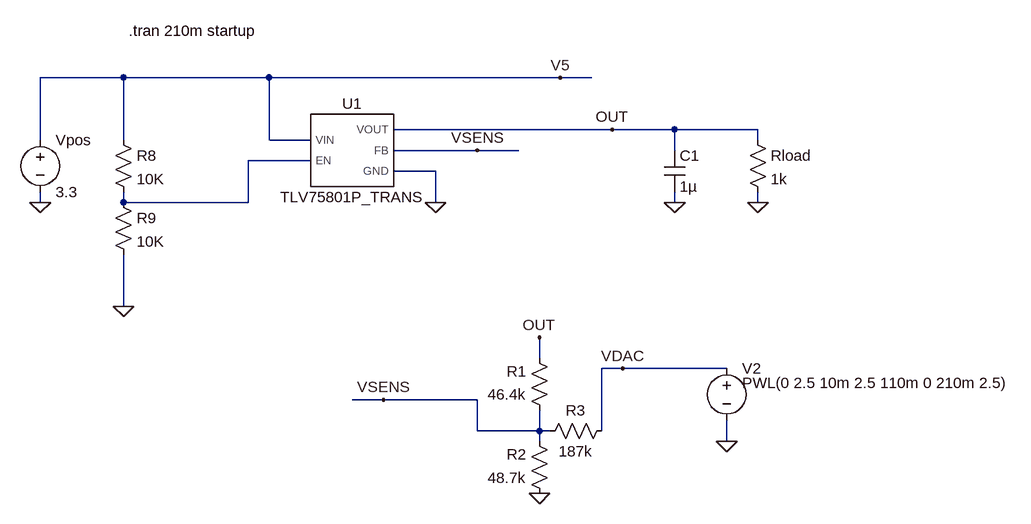
[diagram p0: schematic power_supply_TLV7580.asc]
power_supply_TLV7580.asc, the LTspice schematic file:
Version 4
SHEET 1 1920 776
WIRE -128 -48 -256 -48
WIRE 96 -48 -128 -48
WIRE 544 -48 96 -48
WIRE 592 -48 544 -48
WIRE 624 32 288 32
WIRE 720 32 624 32
WIRE 848 32 720 32
WIRE -256 48 -256 -48
WIRE -128 48 -128 -48
WIRE 96 48 96 -48
WIRE 160 48 96 48
WIRE 848 48 848 32
WIRE 416 64 288 64
WIRE 480 64 416 64
WIRE 720 64 720 32
WIRE 160 80 64 80
WIRE 352 96 288 96
WIRE -256 144 -256 128
WIRE -128 144 -128 128
WIRE 64 144 64 80
WIRE 64 144 -128 144
WIRE 352 144 352 96
WIRE 720 144 720 128
WIRE 848 144 848 128
WIRE -128 304 -128 224
WIRE 512 384 512 352
WIRE 640 400 608 400
WIRE 800 400 640 400
WIRE 272 448 224 448
WIRE 416 448 272 448
WIRE 416 496 416 448
WIRE 512 496 512 464
WIRE 512 496 416 496
WIRE 528 496 512 496
WIRE 608 496 608 400
WIRE 512 512 512 496
WIRE 800 512 800 480
FLAG 848 144 0
FLAG 720 144 0
FLAG 624 32 OUT
FLAG 800 512 0
FLAG -256 144 0
FLAG 544 -48 V5
FLAG 416 64 VSENS
FLAG 272 448 VSENS
FLAG 512 352 OUT
FLAG 640 400 VDAC
FLAG -128 304 0
FLAG 512 592 0
FLAG 352 144 0
SYMBOL res 832 32 R0
SYMATTR InstName Rload
SYMATTR Value 1k
SYMBOL cap 704 64 R0
SYMATTR InstName C1
SYMATTR Value 1µ
SYMATTR SpiceLine Rser=1.5m
SYMBOL res 624 480 R90
WINDOW 0 0 56 VBottom 2
WINDOW 3 32 56 VTop 2
SYMATTR InstName R3
SYMATTR Value 187k
SYMBOL voltage 800 384 R0
WINDOW 3 24 38 Left 2
SYMATTR Value PWL(0 2.5 10m 2.5 110m 0 210m 2.5)
SYMATTR InstName V2
SYMBOL voltage -256 32 R0
WINDOW 123 0 0 Left 0
WINDOW 39 0 0 Left 0
SYMATTR InstName Vpos
SYMATTR Value 3.3
SYMBOL res 528 608 R180
WINDOW 0 36 76 Left 2
WINDOW 3 36 40 Left 2
SYMATTR InstName R2
SYMATTR Value 48.7k
SYMBOL res -144 32 R0
SYMATTR InstName R8
SYMATTR Value 10K
SYMBOL res -144 128 R0
SYMATTR InstName R9
SYMATTR Value 10K
SYMBOL res 528 480 R180
WINDOW 0 36 76 Left 2
WINDOW 3 36 40 Left 2
SYMATTR InstName R1
SYMATTR Value 46.4k
SYMBOL TLV75801P_TRANS 224 64 R0
SYMATTR InstName U1
TEXT -120 -120 Left 2 !.tran 210m startup

The netlist it stands for:
* power_supply_TLV7580.asc
Rload OUT 0 1k
C1 OUT 0 1µ Rser=1.5m
R3 VDAC VSENS 187k
V2 VDAC 0 PWL(0 2.5 10m 2.5 110m 0 210m 2.5)
Vpos V5 0 3.3
R2 0 VSENS 48.7k
R8 V5 N001 10K
R9 N001 0 10K
R1 VSENS OUT 46.4k
XU1 N001 VSENS 0 V5 OUT TLV75801P_TRANS  ; pins EN FB GND VIN VOUT
.tran 210m startup
.lib TLV75801P_TRANS.lib
.backanno
.end